# Altium schematic sheet Commodore CPM Modul.SchDoc
size 594 x 420 mm; ApprovedBy: .; CheckedBy: .; Author: DiWou; CompanyName: DL2DW; DrawnBy: DiWou; Engineer: .; Organization: DL2DW; DocumentNumber: 1; Revision: -; SheetNumber: 1; SheetTotal: 1; DrawnDate: 13.04.2020; EngrDate: .; ChkdDate: .; Title1: Commodore CP/M Cartridge; Title2: for Commodore C64; Title3: .; Desc1: Version 1.0; Desc2: .; ApprDate: .
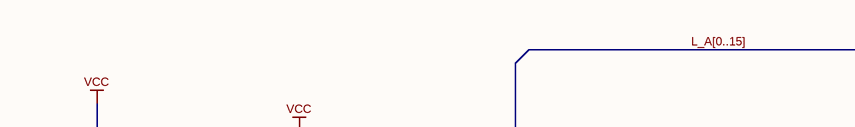
[diagram p0: Commodore CPM Modul.SchDoc, top left]
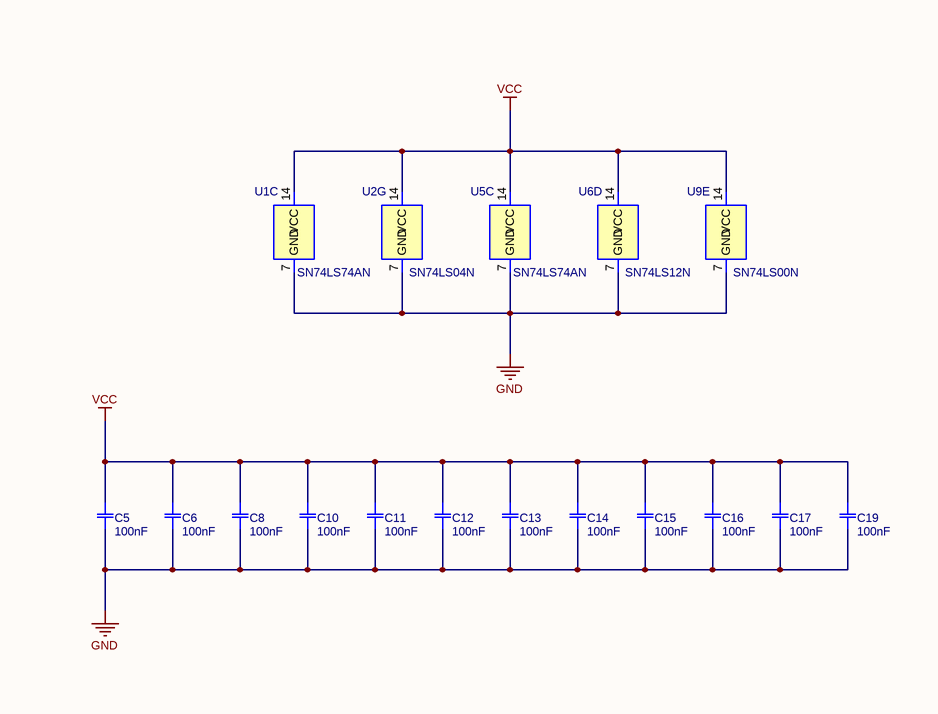
[diagram p1: Commodore CPM Modul.SchDoc, top right]
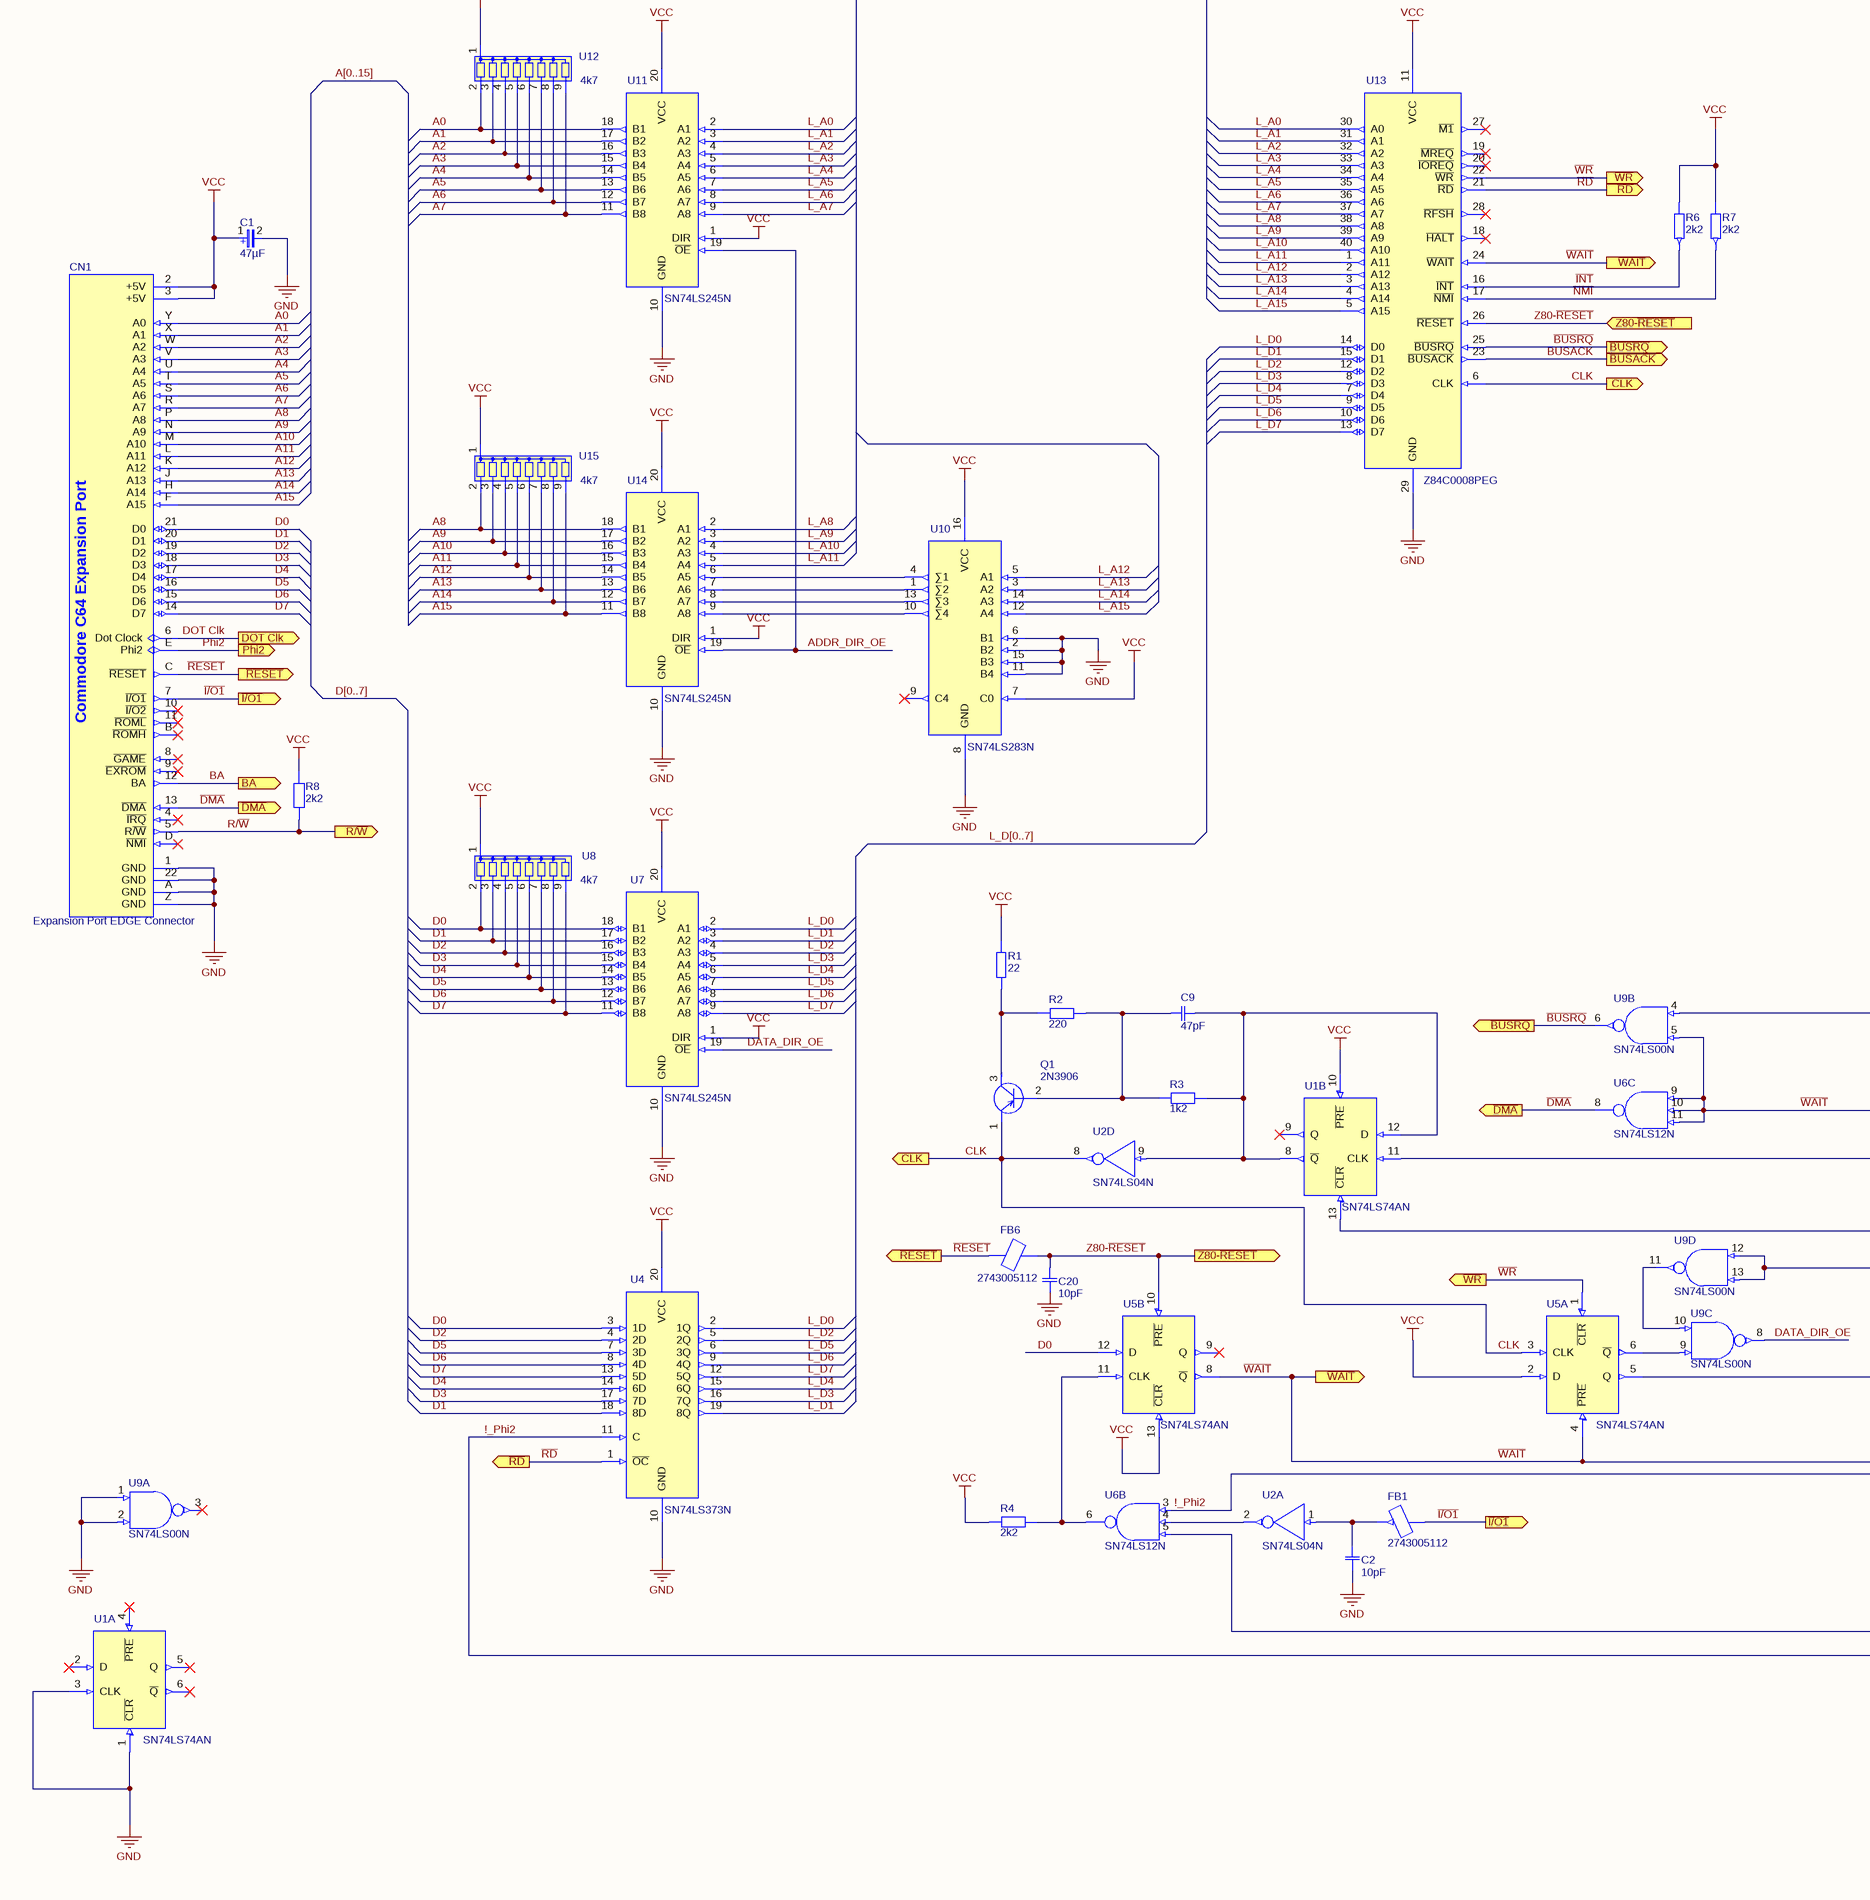
[diagram p2: Commodore CPM Modul.SchDoc, bottom left]
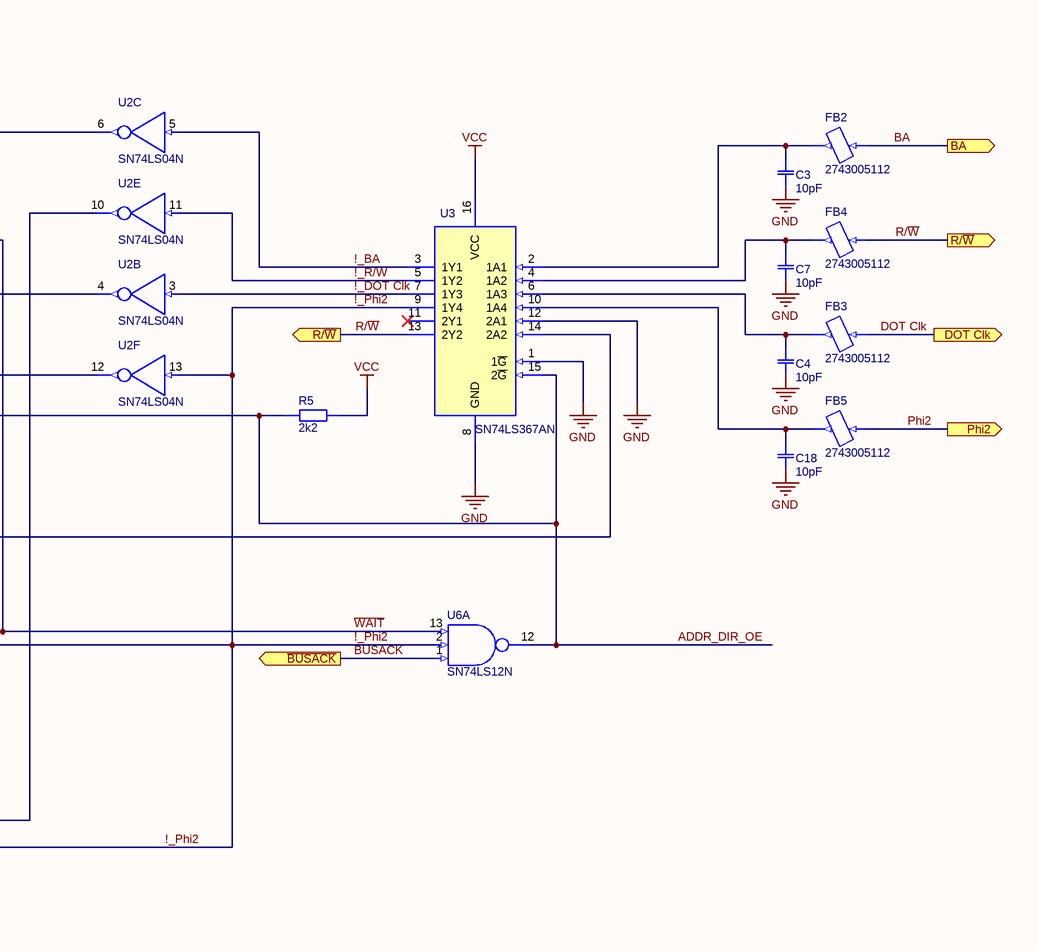
[diagram p3: Commodore CPM Modul.SchDoc, bottom right]

## Parts
C1  47µF  [CAP Elec 47uF 25V Axial - Vishay MAL203036479E3]
C2  10pF  [CAP CER 10PF 50V C0G/NP0 AXIAL Vishay A100J15C0GF5TAA]
C3  10pF  [CAP CER 10PF 50V C0G/NP0 AXIAL Vishay A100J15C0GF5TAA]
C4  10pF  [CAP CER 10PF 50V C0G/NP0 AXIAL Vishay A100J15C0GF5TAA]
C5  100nF  [CAP CER 0.1UF 50V X7R RADIAL Kemet C330C104J5R5TA]
C6  100nF  [CAP CER 0.1UF 50V X7R RADIAL Kemet C330C104J5R5TA]
C7  10pF  [CAP CER 10PF 50V C0G/NP0 AXIAL Vishay A100J15C0GF5TAA]
C8  100nF  [CAP CER 0.1UF 50V X7R RADIAL Kemet C330C104J5R5TA]
C9  47pF  [CAP CER 47PF 50V C0G/NP0 AXIAL Vishay A470J15C0GF5TAA]
C10  100nF  [CAP CER 0.1UF 50V X7R RADIAL Kemet C330C104J5R5TA]
C11  100nF  [CAP CER 0.1UF 50V X7R RADIAL Kemet C330C104J5R5TA]
C12  100nF  [CAP CER 0.1UF 50V X7R RADIAL Kemet C330C104J5R5TA]
C13  100nF  [CAP CER 0.1UF 50V X7R RADIAL Kemet C330C104J5R5TA]
C14  100nF  [CAP CER 0.1UF 50V X7R RADIAL Kemet C330C104J5R5TA]
C15  100nF  [CAP CER 0.1UF 50V X7R RADIAL Kemet C330C104J5R5TA]
C16  100nF  [CAP CER 0.1UF 50V X7R RADIAL Kemet C330C104J5R5TA]
C17  100nF  [CAP CER 0.1UF 50V X7R RADIAL Kemet C330C104J5R5TA]
C18  10pF  [CAP CER 10PF 50V C0G/NP0 AXIAL Vishay A100J15C0GF5TAA]
C19  100nF  [CAP CER 0.1UF 50V X7R RADIAL Kemet C330C104J5R5TA]
C20  10pF  [CAP CER 10PF 50V C0G/NP0 AXIAL Vishay A100J15C0GF5TAA]
CN1  Expansion Port EDGE Connector  [C64 Expansion Port EDGE Connector]  (no BOM)
FB1  2743005112  [Ferrite Bead Fair Rite 2743005112 axial 10,16mm]
FB2  2743005112  [Ferrite Bead Fair Rite 2743005112 axial 10,16mm]
FB3  2743005112  [Ferrite Bead Fair Rite 2743005112 axial 10,16mm]
FB4  2743005112  [Ferrite Bead Fair Rite 2743005112 axial 10,16mm]
FB5  2743005112  [Ferrite Bead Fair Rite 2743005112 axial 10,16mm]
FB6  2743005112  [Ferrite Bead Fair Rite 2743005112 axial 10,16mm]
Q1  2N3906  [2N3906]
R1  22  [22 Ohm R Axial DIN0207 L6.3mm D2.5mm P10.16mm Horizontal]
R2  220  [220 Ohm R Axial DIN0207 L6.3mm D2.5mm P10.16mm Horizontal]
R3  1k2  [1,2 kOhm R Axial DIN0207 L6.3mm D2.5mm P10.16mm Horizontal]
R4  2k2  [2,2 kOhm R Axial DIN0207 L6.3mm D2.5mm P10.16mm Horizontal]
R5  2k2  [2,2 kOhm R Axial DIN0207 L6.3mm D2.5mm P10.16mm Horizontal]
R6  2k2  [2,2 kOhm R Axial DIN0207 L6.3mm D2.5mm P10.16mm Horizontal]
R7  2k2  [2,2 kOhm R Axial DIN0207 L6.3mm D2.5mm P10.16mm Horizontal]
R8  2k2  [2,2 kOhm R Axial DIN0207 L6.3mm D2.5mm P10.16mm Horizontal]
U1  SN74LS74AN  [SN74LS74N with Socket]  (parts A,B,C of 3)
U2  SN74LS04N  [SN74LS04N with Socket]  (parts A,B,C,D,E,F,G of 7)
U3  SN74LS367AN  [SN74LS367A with Socket]
U4  SN74LS373N  [SN74LS373N with Socket]
U5  SN74LS74AN  [SN74LS74N with Socket]  (parts A,B,C of 3)
U6  SN74LS12N  [SN74LS12N with Socket]  (parts A,B,C,D of 4)
U7  SN74LS245N  [SN74LS245N with Socket]
U8  4k7  [4k7 x8 Resistor Array SIL Royal 9A472G]
U9  SN74LS00N  [SN74LS00N with Socket]  (parts A,B,C,D,E of 5)
U10  SN74LS283N  [SN74LS283N with Socket]
U11  SN74LS245N  [SN74LS245N with Socket]
U12  4k7  [4k7 x8 Resistor Array SIL Royal 9A472G]
U13  Z84C0008PEG  [Zilog Z80 CPU with Socket]
U14  SN74LS245N  [SN74LS245N with Socket]
U15  4k7  [4k7 x8 Resistor Array SIL Royal 9A472G]

## Ports
BA (out), CLK (out), DOT Clk (out), Phi2 (out), R/~{W} (out), Z80-~{RESET} (in), Z80-~{RESET} (out), ~{BUSACK} (out), ~{BUSRQ} (out), ~{DMA} (out), ~{I/O1} (out), ~{RD} (out), ~{RESET} (out), ~{WAIT} (out), ~{WR} (out)

## Nets
GND: C1.2 C2.1 C3.2 C4.2 C5.1 C6.1 C7.1 C8.1 C10.1 C11.1 C12.1 C13.1 C14.1 C15.1 C16.1 C17.1 C18.1 C19.1 C20.1 CN1.1(GND) CN1.22(GND) CN1.A(GND) CN1.Z(GND) U1.1(~{CLR}) U1.3(CLK) U1.7(GND) U2.7(GND) U3.1(1~{G}) U3.8(GND) U3.12(2A1) U4.10(GND) U5.7(GND) U6.7(GND) U7.10(GND) U9.1(1A) U9.2(1B) U9.7(GND) U10.2(B2) U10.6(B1) U10.8(GND) U10.11(B4) U10.15(B3) U11.10(GND) U13.29(GND) U14.10(GND)
VCC: C1.1 C5.2 C6.2 C8.2 C10.2 C11.2 C12.2 C13.2 C14.2 C15.2 C16.2 C17.2 C19.2 CN1.2(+5V) CN1.3(+5V) R1.2 R4.2 R5.2 R6.1 R7.1 R8.1 U1.10(~{PRE}) U1.14(VCC) U2.14(VCC) U3.16(VCC) U4.20(VCC) U5.2(D) U5.13(~{CLR}) U5.14(VCC) U6.14(VCC) U7.1(DIR) U7.20(VCC) U8.1 U9.14(VCC) U10.7(C0) U10.16(VCC) U11.1(DIR) U11.20(VCC) U12.1 U13.11(VCC) U14.1(DIR) U14.20(VCC) U15.1
!_BA: U2.5(3A) U3.3(1Y1)
!_DOT Clk: U2.3(2A) U3.7(1Y3)
!_Phi2: U2.13(6A) U3.9(1Y4) U4.11(C) U6.2(1B) U6.3(2A)
!_R/~{W}: U2.11(5A) U3.5(1Y2)
A0: CN1.Y(A0) U11.18(B1) U12.2
A1: CN1.X(A1) U11.17(B2) U12.3
A2: CN1.W(A2) U11.16(B3) U12.4
A3: CN1.V(A3) U11.15(B4) U12.5
A4: CN1.U(A4) U11.14(B5) U12.6
A5: CN1.T(A5) U11.13(B6) U12.7
A6: CN1.S(A6) U11.12(B7) U12.8
A7: CN1.R(A7) U11.11(B8) U12.9
A8: CN1.P(A8) U14.18(B1) U15.2
A9: CN1.N(A9) U14.17(B2) U15.3
A10: CN1.M(A10) U14.16(B3) U15.4
A11: CN1.L(A11) U14.15(B4) U15.5
A12: CN1.K(A12) U14.14(B5) U15.6
A13: CN1.J(A13) U14.13(B6) U15.7
A14: CN1.H(A14) U14.12(B7) U15.8
A15: CN1.F(A15) U14.11(B8) U15.9
ADDR_DIR_OE: R5.1 U3.15(2~{G}) U6.12(1Y) U9.12(4B) U9.13(4A) U11.19(~{OE}) U14.19(~{OE})
~{BUSACK}: U6.1(1A) U13.23(~{BUSACK}) ; port ~{BUSACK}
~{BUSRQ}: U9.6(2Y) U13.25(~{BUSRQ}) ; port ~{BUSRQ}
BA: CN1.12(BA) FB2.1 ; port BA
CLK: Q1.1 U2.8(4Y) U5.3(CLK) U13.6(CLK) ; port CLK
D0: CN1.21(D0) U4.3(1D) U5.12(D) U7.18(B1) U8.2
D1: CN1.20(D1) U4.18(8D) U7.17(B2) U8.3
D2: CN1.19(D2) U4.4(2D) U7.16(B3) U8.4
D3: CN1.18(D3) U4.17(7D) U7.15(B4) U8.5
D4: CN1.17(D4) U4.14(6D) U7.14(B5) U8.6
D5: CN1.16(D5) U4.7(3D) U7.13(B6) U8.7
D6: CN1.15(D6) U4.8(4D) U7.12(B7) U8.8
D7: CN1.14(D7) U4.13(5D) U7.11(B8) U8.9
~{DMA}: CN1.13(~{DMA}) U6.8(3Y) ; port ~{DMA}
DATA_DIR_OE: U7.19(~{OE}) U9.8(3Y)
DOT Clk: CN1.6(Dot_Clock) FB3.1 ; port DOT Clk
~{I/O1}: CN1.7(~{I/O1}) FB1.1 ; port ~{I/O1}
~{INT}: R6.2 U13.16(~{INT})
L_A0: U11.2(A1) U13.30(A0)
L_A1: U11.3(A2) U13.31(A1)
L_A2: U11.4(A3) U13.32(A2)
L_A3: U11.5(A4) U13.33(A3)
L_A4: U11.6(A5) U13.34(A4)
L_A5: U11.7(A6) U13.35(A5)
L_A6: U11.8(A7) U13.36(A6)
L_A7: U11.9(A8) U13.37(A7)
L_A8: U13.38(A8) U14.2(A1)
L_A9: U13.39(A9) U14.3(A2)
L_A10: U13.40(A10) U14.4(A3)
L_A11: U13.1(A11) U14.5(A4)
L_A12: U10.5(A1) U13.2(A12)
L_A13: U10.3(A2) U13.3(A13)
L_A14: U10.14(A3) U13.4(A14)
L_A15: U10.12(A4) U13.5(A15)
L_D0: U4.2(1Q) U7.2(A1) U13.14(D0)
L_D1: U4.19(8Q) U7.3(A2) U13.15(D1)
L_D2: U4.5(2Q) U7.4(A3) U13.12(D2)
L_D3: U4.16(7Q) U7.5(A4) U13.8(D3)
L_D4: U4.15(6Q) U7.6(A5) U13.7(D4)
L_D5: U4.6(3Q) U7.7(A6) U13.9(D5)
L_D6: U4.9(4Q) U7.8(A7) U13.10(D6)
L_D7: U4.12(5Q) U7.9(A8) U13.13(D7)
~{NMI}: R7.2 U13.17(~{NMI})
Phi2: CN1.E(Phi2) FB5.1 ; port Phi2
R/~{W}: CN1.5(R~{/W}) FB4.1 R8.2 U3.13(2Y2) ; port R/~{W}
~{RD}: U4.1(~{OC}) U13.21(~{RD}) ; port ~{RD}
~{RESET}: CN1.C(~{RESET}) FB6.1 ; port ~{RESET}
~{WAIT}: U5.4(~{PRE}) U5.8(~{Q}) U6.9(3A) U6.10(3C) U6.11(3B) U6.13(1C) U9.5(2B) U13.24(~{WAIT}) ; port ~{WAIT}
~{WR}: U5.1(~{CLR}) U13.22(~{WR}) ; port ~{WR}
Z80-~{RESET}: C20.2 FB6.2 U5.10(~{PRE}) U13.26(~{RESET}) ; port Z80-~{RESET}
NetC2_2: C2.2 FB1.2 U2.1(1A)
NetC3_1: C3.1 FB2.2 U3.2(1A1)
NetC4_1: C4.1 FB3.2 U3.6(1A3)
NetC7_2: C7.2 FB4.2 U3.4(1A2)
NetC9_1: C9.1 R3.2 U1.8(~{Q}) U1.12(D) U2.9(4A)
NetC9_2: C9.2 Q1.2 R2.2 R3.1
NetC18_2: C18.2 FB5.2 U3.10(1A4)
NetQ1_3: Q1.3 R1.1 R2.1
NetR4_1: R4.1 U5.11(CLK) U6.6(2Y)
NetU1_11: U1.11(CLK) U2.4(2Y)
NetU1_13: U1.13(~{CLR}) U2.12(6Y)
NetU2_2: U2.2(1Y) U6.4(2B)
NetU2_6: U2.6(3Y) U9.4(2A)
NetU2_10: U2.10(5Y) U6.5(2C)
NetU3_14: U3.14(2A2) U5.5(Q)
NetU5_6: U5.6(~{Q}) U9.9(3B)
NetU9_10: U9.10(3A) U9.11(4Y)
NetU10_1: U10.1(∑2) U14.7(A6)
NetU10_4: U10.4(∑1) U14.6(A5)
NetU10_10: U10.10(∑4) U14.9(A8)
NetU10_13: U10.13(∑3) U14.8(A7)

Not connected (* = marked no-connect by the designer): CN1 4(~{IRQ})* 8(~{GAME})* 9(~{EXROM})* 10(~{I/O2})* 11(~{ROML})* B(~{ROMH})* D(~{NMI})*; U1 2(D)* 4(~{PRE})* 5(Q)* 6(~{Q})* 9(Q)*; U3 11(2Y1)*; U5 9(Q)*; U9 3(1Y)*; U10 9(C4)*; U13 18(~{HALT})* 19(~{MREQ})* 20(~{IOREQ})* 27(~{M1})* 28(~{RFSH})*

## Buses and harness runs
bus A[0..15]
bus D[0..7]
bus L_A[0..15]
bus L_D[0..7]

## Notes on the sheet
- Drawn by:
- Date
- Size:
- A2
- Rev:
- Engr:
- Chkd:
- Appr:
- File:
- Document No:
- Print Date & Time:
- /
- Sheet
- of
- (in symbol CMP-Capacitors-Electrolyt_Capacitors00023-1) +
- (in symbol CMP-Commodore-00008-4) Commodore C64 Expansion Port

## Library data of the parts
C1 = CMP-Capacitors-Electrolyt_Capacitors00023-1: Cap Aluminum 47uF 25V -10% to 50% (6 X 10mm) Axial 4.8 Ohm 100mA 3000 hr 85C Taped in Box; Life (Hours): 3000Hour; Lead Diameter: 0.6mm; Leakage Current: 12uA; Polarity: Polar; Impedance: 1.9R; ESR (Equivalent Series Resistance): 4.8R; Radiation Hardening: No; Voltage Rating: 25V; Termination: Axial; Diameter: 6mm; Min Operating Temperature: -40°C; Capacitance: 47uF; Ripple Current: 100mA; Series: 030 AS; Case/Package: Axial; RoHS Compliant: Yes; Voltage: 25V; Voltage Rating (DC): 25V; Mount: Through Hole; Package Quantity: 1000; Packaging: Tape and Reel; Tolerance: 50%; Lead Pitch: 15mm; Height: 10mm; Construction: AXIAL; Max Operating Temperature: 85°C; Length: 10mm; REACH SVHC: Unknown
C2-C4 C7 C18 C20 = CMP-Capacitors-Ceramic_Capacitors-00047-1: Cap Ceramic 10pF 50V C0G 5% Axial 125C T/R; Voltage Rating: 50V; Max Operating Temperature: 125°C; RoHS Compliant: Yes; Package Quantity: 7000; Series: A; Min Operating Temperature: -55°C; Termination: Axial; Radiation Hardening: No; Construction: AXIAL; Capacitance: 10pF; Case/Package: Axial; Dielectric: C0G; Packaging: Tape and Reel; Mount: Through Hole; Tolerance: 5%; Length: 0.15inch
C5 C6 C8 C10-C17 C19 = CMP-Capacitors-Ceramic_Capacitors-00046-1: Cap Ceramic 0.1uF 50V X7R 5% Radial 5.08mm 125C Bulk; Capacitance: 100nF; Construction: RADIAL; Length: 7.62mm; Mount: Through Hole; Radiation Hardening: No; Max Operating Temperature: 125°C; Min Operating Temperature: -55°C; RoHS Compliant: Yes; Depth: 3.81mm; Termination: Radial; Case/Package: Dipped; Tolerance: 5%; Packaging: Bulk; Lead Pitch: 5.08mm; Dielectric: X7R
C9 = CMP-Capacitors-Ceramic_Capacitors-00048-1: Cap Ceramic 47pF 50V C0G 5% Axial 125C T/R; Series: A; Voltage Rating: 50V; Termination: Axial; Packaging: Tape and Reel; Max Operating Temperature: 125°C; Construction: AXIAL; Dielectric: C0G; Mount: Through Hole; Tolerance: 5%; Min Operating Temperature: -55°C; Case/Package: Axial; Radiation Hardening: No; Capacitance: 47pF; RoHS Compliant: Yes; Length: 0.15inch; Package Quantity: 7000
CN1 = CMP-Commodore-00008-4: Expansion Port EDGE Connector for Interface Cards
FB1-FB6 = CMP-Inductors-00000-10: Ferrite Beads Axial 91Ohm 100MHz T/R; Impedance: 91R; Shielding: Unshielded; Test Frequency: 100MHz; Diameter: 3.5mm; Min Operating Temperature: -55°C; Packaging: Tape and Reel; Package Quantity: 4500; Max Operating Temperature: 125°C; Case/Package: Axial; Termination: Axial; Length: 6mm
Q1 = CMP-Transistors-00014-1: Bipolar Transistor PNP Amplifier/Switch 40V 200mA 3-Pin TO-92 Through Hole Box; Collector Emitter Saturation Voltage: 400mV; Transition Frequency: 250MHz; Element Configuration: Single; Max Power Dissipation: 625mW; Max Collector Current: 50nA; hFE Min: 100; Emitter Base Voltage (VEBO): 5V; Mount: Through Hole; Collector-emitter Voltage-Max: 40V; Collector Base Voltage (VCBO): 40V; Series: -; Lead Free: Lead Free; Collector Emitter Breakdown Voltage: 40V; Gain Bandwidth Product: 250MHz; RoHS Compliant: Yes; Packaging: Bulk; Collector Emitter Voltage (VCEO): 40V; Case/Package: TO-92; Polarity: PNP; Package Quantity: 2500; Continuous Collector Current: 200mA
R1 = CMP-Resistors-Yageo_THT_DIN_0207-00032-1: RES 22 OHM 1/4W 5% AXIAL; Temperature Coefficient: 500ppm/°C; Max Power Dissipation: 250mW; Resistance: 22R; Length: 0.248inch; Number of Terminations: 2; Tolerance: 5%; Packaging: Bulk; Max Operating Temperature: 155°C; Min Operating Temperature: -55°C; Package Quantity: 200; Composition: Carbon Film; Case/Package: Axial
R2 = CMP-Resistors-Yageo_THT_DIN_0207-00056-1: RES 220 OHM 1/4W 5% AXIAL; Max Power Dissipation: 250mW; Resistance: 220R; Temperature Coefficient: 500ppm/°C; Max Operating Temperature: 155°C; Number of Terminations: 2; Packaging: Bulk; Min Operating Temperature: -55°C; Length: 0.248inch; Package Quantity: 200; Case/Package: Axial; Tolerance: 5%; Composition: Carbon Film
R3 = CMP-Resistors-Yageo_THT_DIN_0207-00074-1: RES 1.2K OHM 1/4W 5% AXIAL; Resistance: 1.2kR; Temperature Coefficient: 500ppm/°C; Max Power Dissipation: 250mW; Length: 0.248inch; Min Operating Temperature: -55°C; Lead Free: Lead Free; Package Quantity: 200; Composition: Carbon Film; Packaging: Bulk; Number of Terminations: 2; Case/Package: Axial; Tolerance: 5%; Max Operating Temperature: 155°C
R4-R8 = CMP-Resistors-Yageo_THT_DIN_0207-00080-1: RES 2.2K OHM 1/4W 5% AXIAL; Max Power Dissipation: 250mW; Temperature Coefficient: 500ppm/°C; Resistance: 2.2kR; Number of Terminations: 2; Max Operating Temperature: 155°C; Package Quantity: 200; Lead Free: Lead Free; Tolerance: 5%; Min Operating Temperature: -55°C; Length: 0.248inch; Composition: Carbon Film; Packaging: Bulk; Case/Package: Axial; Mount: Through Hole
U1 U5 = CMP-ICs-74xx-series-00042-2: TEXAS INSTRUMENTS   SN74LS74AN   Flip-Flop, with Set and Reset, Complementary Output, Differential, Positive Edge, D, 13 ns, 33 MHz; Max Supply Voltage: 5.25V; Number of Bits: 2; Frequency: 33MHz; Number of Input Lines: 3; Output Current: 16mA; Propagation Delay: 40ns; Min Supply Voltage: 4.75V; Output Type: TTL; Logic Function: AND,D-Type,Flip-Flop,Latch; Number of Output Lines: 1; Polarity: Non-Inverting; Turn-On Delay Time: 13ns; Nominal Supply Current: 25mA; Operating Supply Voltage: 5V; Low Level Output Current: 8mA; High Level Output Current: -400uA; Radiation Hardening: No; Case/Package: PDIP; Width: 6.35mm; Contact Plating: Gold; Length: 19.3mm; Weight: 0.032734oz; Clock Edge Trigger Type: Positive Edge; Mount: Through Hole; Max Frequency: 33MHz; Min Operating Temperature: 0°C; Number of Circuits: 2; Packaging: Rail/Tube; Number of Channels: 2; REACH SVHC: No SVHC; Number of Pins: 14; Height: 4.57mm; Number of Bits per Element: 1; Max Operating Temperature: 70°C; Lead Free: Lead Free; Package Quantity: 25; Number of Elements: 2
U2 = CMP-ICs-74xx-series-00006-2: IC HEX INVERTER 14-DIP; Low Level Output Current: 8mA; Number of Output Lines: 6; Propagation Delay: 15ns; High Level Output Current: -400uA; Operating Supply Voltage: 5V; Min Supply Voltage: 4.75V; Logic Function: Buffer,Inverter; Turn-On Delay Time: 22ns; Nominal Supply Current: 100uA; Number of Inputs: 1; Max Supply Voltage: 5.25V; Schmitt Trigger Input: No; Contact Plating: Gold; Packaging: Rail/Tube; Case/Package: PDIP; Lead Free: Lead Free; Weight: 0.032734oz; Width: 6.35mm; Number of Pins: 14; Output Current: 8mA; Number of Gates: 6; Length: 19.3mm; REACH SVHC: No SVHC; Max Output Current: 8mA; Number of Circuits: 6; Min Operating Temperature: 0°C; Number of Bits: 6; Mount: Through Hole; Height: 4.57mm; Package Quantity: 25; Number of Elements: 6; Max Operating Temperature: 70°C; Radiation Hardening: No; Termination: Through Hole
U3 = CMP-ICs-74xx-series-00077-1: I.C. SN74LS 367 AN; Number of Inputs: 6; Nominal Supply Current: 100uA; Low Level Output Current: 24mA; Quiescent Current: 12mA; Min Supply Voltage: 4.75V; Propagation Delay: 40ns; High Level Output Current: -2.6mA; Max Supply Voltage: 5.25V; Polarity: Non-Inverting; Number of Elements: 2; Operating Supply Voltage: 5V; Logic Function: Buffer; Output Type: 3-STATE; Width: 6.35mm; Height: 4.57mm; Number of Bits: 6; Technology: BIPOLAR; Max Operating Temperature: 70°C; RoHS Compliant: No; Length: 19.3mm; Number of Channels: 6; Mount: Through Hole; Min Operating Temperature: 0°C; Number of Circuits: 6; REACH SVHC: No SVHC; Case/Package: PDIP; Packaging: Box; Lead Free: Lead Free; Number of Outputs: 6; Output Current: 24mA; Number of Pins: 16
U4 = CMP-ICs-74xx-series-00062-1: Latch Transparent 3-ST 8-CH D-Type 20-Pin PDIP Tube; Max Supply Voltage: 5.25V; Number of Circuits: 8; Logic Function: D-Type,Latch,Flip-Flop; Low Level Output Current: 24mA; Number of Output Lines: 1; Propagation Delay: 18ns; Number of Input Lines: 3; Operating Supply Current: 40mA; Min Supply Voltage: 4.75V; Polarity: Non-Inverting; Operating Supply Voltage: 5V; Turn-On Delay Time: 12ns; High Level Output Current: -2.6mA; Weight: 0.042297oz; Number of Bits: 8; Max Operating Temperature: 70°C; Package Quantity: 20; Number of Outputs: 8; Case/Package: PDIP; Quiescent Current: 24mA; Min Operating Temperature: 0°C; Width: 6.35mm; Contact Plating: Gold; Lead Free: Lead Free; Number of Elements: 1; Mount: Through Hole; Number of Channels: 8; Height: 4.57mm; REACH SVHC: No SVHC; Number of Pins: 20; Packaging: Rail/Tube; Output Current: 24mA; Radiation Hardening: No; Independent Circuits: 1; Length: 24.33mm
U6 = CMP-ICs-74xx-series-00012-2: Logic Gates Triple 3-input Positive-NAND gates with open collector outputs 14-PDIP 0 to 70; Logic Function: NAND; Case/Package: PDIP; Lead Free: Contains Lead
U7 U11 U14 = CMP-ICs-74xx-series-00046-2: IC TXRX NON-INVERT 5.25V 20DIP; Turn-On Delay Time: 12ns; Logic Function: Transceiver,Inverting; Number of Outputs: 8; Min Supply Voltage: 4.75V; Operating Supply Voltage: 5V; Quiescent Current: 62mA; Polarity: Non-Inverting; Low Level Output Current: 24mA; Number of Elements: 1; High Level Output Current: -15mA; Direction: Bidirectional; Mount: Through Hole; Number of Bits: 8; Number of Circuits: 8; Propagation Delay: 12ns; Number of Transceivers: 8; Max Operating Temperature: 70°C; Number of Bits per Element: 8; Contact Plating: Gold; Length: 24.33mm; Weight: 0.042297oz; Width: 6.35mm; Lead Free: Lead Free; Number of Pins: 20; Packaging: Rail/Tube; Max Supply Voltage: 5.25V; Radiation Hardening: No; Height: 4.57mm; Min Operating Temperature: 0°C; Termination: Through Hole; REACH SVHC: No SVHC; Number of Channels: 8; Case/Package: PDIP; Package Quantity: 20
U8 U12 U15 = CMP-Resistors-Resistor_Array00016-1: Resistor Networks & Arrays 9pin 4.7Kohms 2% Bussed; Voltage Rating (DC): 100V; Number of Elements: 10; Resistance: 4.7kR; Power Rating: 1.12W; Number of Resistors: 8; Power Per Element: 200mW; Number of Contacts: 9; Temperature Coefficient: 100ppm/°C; Max Operating Temperature: 125°C; Lead Pitch: 2.54mm; Contact Plating: Tin,Lead; Technology: THICK FILM; Width: 0.098inch; Circuit Type: Bussed; Thickness: 2.49mm; Tolerance: 2%; Length: 22.61mm; Number of Pins: 9; Series: CSC; Mount: Through Hole; Resistance Tolerance: 2%; Working Voltage: 100V; Packaging: Bulk; Depth: 2.49mm; REACH SVHC: Unknown; Radiation Hardening: No; RoHS Compliant: No; Termination: Pin; Military Standard: Not; Terminal Pitch: 2.54mm; Number of Terminals/Pins: 9; Min Operating Temperature: -55°C; Voltage Rating: 100V; Package Quantity: 1000; Height: 0.195inch; Lead Free: Contains Lead; Case/Package: SIP; Number of Terminals: 10
U9 = CMP-ICs-74xx-series-00000-3: IC, 74LS, 74LS00, DIP14, 5.25V; Number of Gates: 4; High Level Output Current: -400uA; Number of Input Lines: 2; Number of Output Lines: 1; Low Level Output Current: 8mA; Schmitt Trigger Input: No; Min Supply Voltage: 4.75V; Turn-On Delay Time: 15ns; Output Current: 16mA; Logic Function: NAND; Operating Supply Voltage: 5V; Quiescent Current: 2.4mA; Max Operating Temperature: 70°C; Number of Bits: 4; Packaging: Rail/Tube; Case/Package: PDIP; Lead Free: Lead Free; Length: 19.3mm; Radiation Hardening: No; Package Quantity: 25; Width: 6.35mm; Number of Elements: 4; Mount: Through Hole; Number of Circuits: 4; Min Operating Temperature: 0°C; Contact Plating: Gold; Number of Outputs: 1; Height: 4.57mm; Number of Inputs: 2; Number of Pins: 14; Propagation Delay: 15ns; REACH SVHC: No SVHC; Max Supply Voltage: 5.25V; Weight: 0.032734oz
U10 = CMP-ICs-74xx-series-00079-1: Binary Full Adder Single 4-Bit 16-Pin PDIP Box; Operating Supply Voltage: 5V; High Level Output Current: -400uA; Max Supply Voltage: 5.25V; Low Level Output Current: 8mA; Min Supply Voltage: 4.75V; Number of Bits: 4; Lead Free: Lead Free; Max Operating Temperature: 70°C; Number of Pins: 16; RoHS Compliant: No; REACH SVHC: No SVHC; Packaging: Box; Logic Function: Binary Full Adder; Mount: Through Hole; Min Operating Temperature: 0°C; Case/Package: PDIP
U13 = CMP-ICs-00009-1: IC MPU Z80 8MHZ 40DIP; Memory Size: 64KB; Core Architecture: Z8; Data Bus Width: 8b; Memory Type: ROMless; Max Supply Voltage: 5V; Number of I/Os: 24; Min Supply Voltage: 4.5V; Max Operating Temperature: 100°C; Mount: Through Hole; REACH SVHC: Unknown; Lead Free: Lead Free; Case/Package: DIP; Max Frequency: 8MHz; Frequency: 8MHz; Length: 62.74mm; Height: 4.19mm; Radiation Hardening: No; Packaging: Rail/Tube; Number of Pins: 40; Voltage: 5V; Min Operating Temperature: -40°C; Width: 14.22mm; Package Quantity: 10